# Altium schematic sheet InverterTranslation.SchDoc: Inverter Level Translation
size 279 x 215 mm; Engineer: Prasoon Sinha; DocumentNumber: 19; SheetNumber: 19; SheetTotal: 26
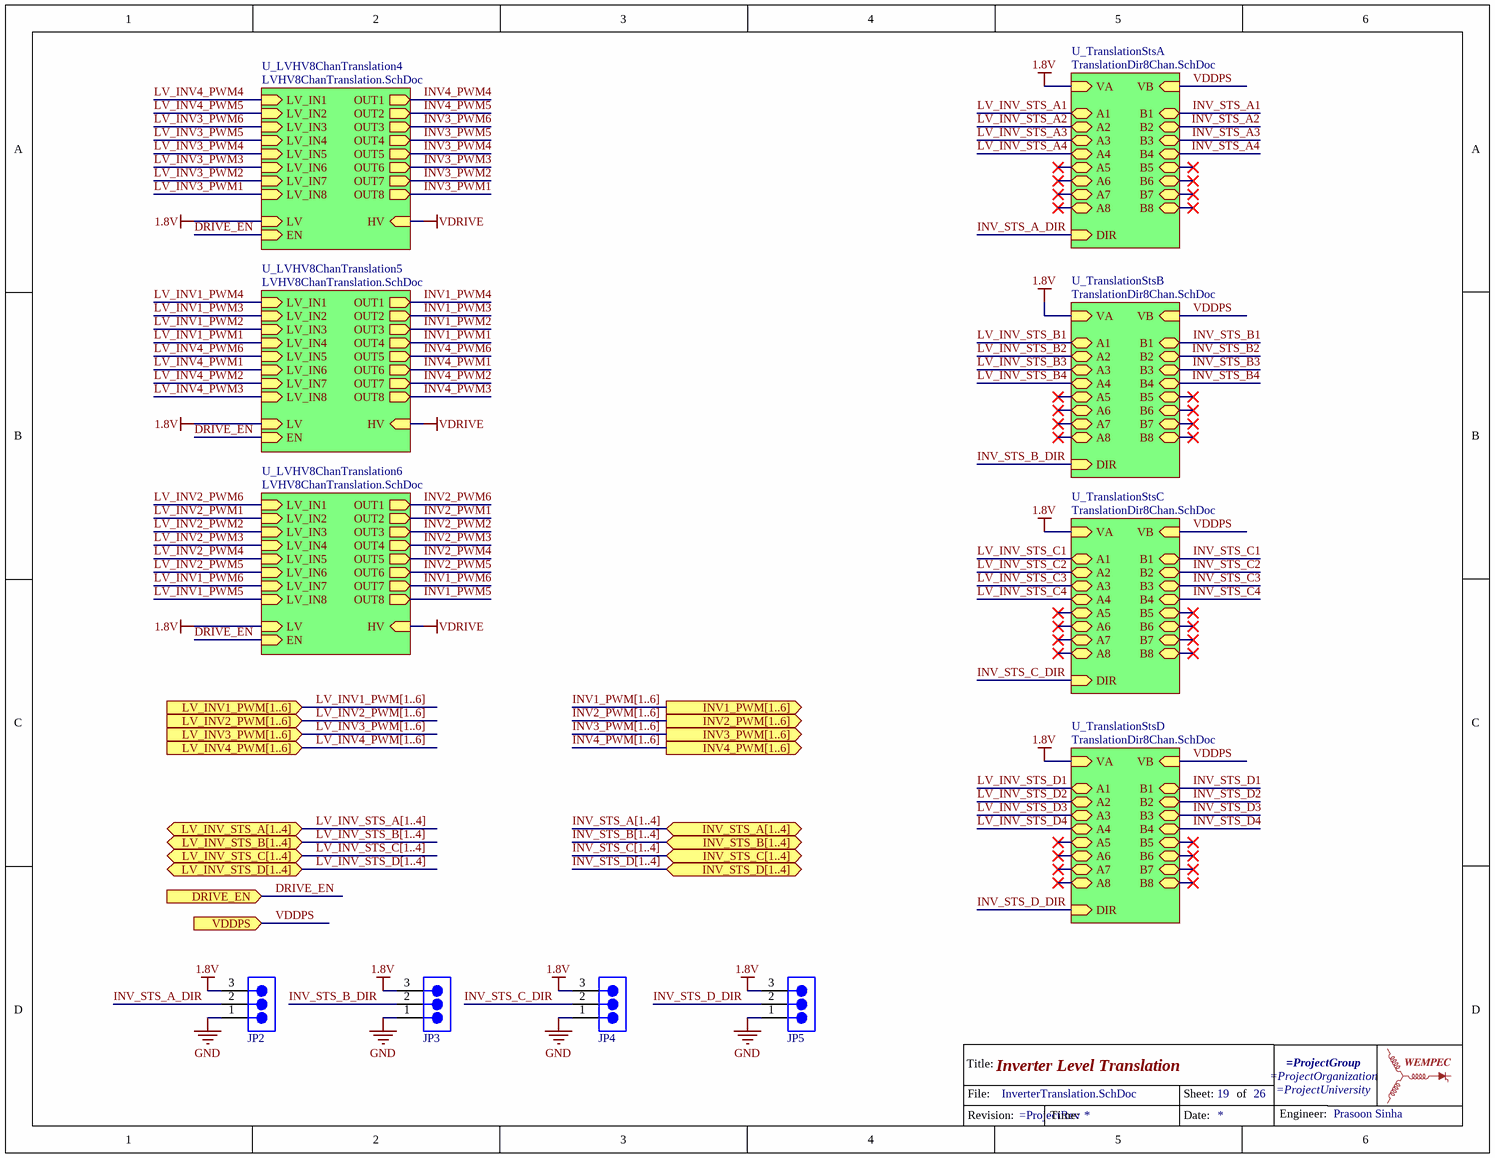
[diagram p0: InverterTranslation.SchDoc]

## Parts
*?  TitleBlockWEMPEC  (value not drawn)  (graphical)
JP2  Jumper3  [PIN_HEADER_1X3]  (value not drawn)
JP3  Jumper3  [PIN_HEADER_1X3]  (value not drawn)
JP4  Jumper3  [PIN_HEADER_1X3]  (value not drawn)
JP5  Jumper3  [PIN_HEADER_1X3]  (value not drawn)

## Sub-sheets
U_LVHV8ChanTranslation4 = LVHV8ChanTranslation.SchDoc: LV_IN1 (in), LV (in), HV (in), EN (in), OUT1 (out), OUT2 (out), OUT3 (out), OUT4 (out), LV_IN2 (in), LV_IN3 (in), LV_IN4 (in), LV_IN5 (in), LV_IN6 (in), LV_IN7 (in), LV_IN8 (in), OUT5 (out), OUT6 (out), OUT7 (out), OUT8 (out)
U_LVHV8ChanTranslation5 = LVHV8ChanTranslation.SchDoc: LV_IN1 (in), LV (in), HV (in), EN (in), OUT1 (out), OUT2 (out), OUT3 (out), OUT4 (out), LV_IN2 (in), LV_IN3 (in), LV_IN4 (in), LV_IN5 (in), LV_IN6 (in), LV_IN7 (in), LV_IN8 (in), OUT5 (out), OUT6 (out), OUT7 (out), OUT8 (out)
U_LVHV8ChanTranslation6 = LVHV8ChanTranslation.SchDoc: LV_IN1 (in), LV (in), HV (in), EN (in), OUT1 (out), OUT2 (out), OUT3 (out), OUT4 (out), LV_IN2 (in), LV_IN3 (in), LV_IN4 (in), LV_IN5 (in), LV_IN6 (in), LV_IN7 (in), LV_IN8 (in), OUT5 (out), OUT6 (out), OUT7 (out), OUT8 (out)
U_TranslationStsA = TranslationDir8Chan.SchDoc: VB (in), VA (in), B1 (bidir), B2 (bidir), B3 (bidir), B4 (bidir), A1 (bidir), A2 (bidir), A3 (bidir), A4 (bidir), DIR (in), B6 (bidir), A7 (bidir), B5 (bidir), A5 (bidir), B7 (bidir), A8 (bidir), A6 (bidir), B8 (bidir)
U_TranslationStsB = TranslationDir8Chan.SchDoc: VB (in), VA (in), B1 (bidir), B2 (bidir), B3 (bidir), B4 (bidir), A1 (bidir), A2 (bidir), A3 (bidir), A4 (bidir), DIR (in), B6 (bidir), A7 (bidir), B5 (bidir), A5 (bidir), B7 (bidir), A8 (bidir), A6 (bidir), B8 (bidir)
U_TranslationStsC = TranslationDir8Chan.SchDoc: VB (in), VA (in), B1 (bidir), B2 (bidir), B3 (bidir), B4 (bidir), A1 (bidir), A2 (bidir), A3 (bidir), A4 (bidir), DIR (in), B6 (bidir), A7 (bidir), B5 (bidir), A5 (bidir), B7 (bidir), A8 (bidir), A6 (bidir), B8 (bidir)
U_TranslationStsD = TranslationDir8Chan.SchDoc: VB (in), VA (in), B1 (bidir), B2 (bidir), B3 (bidir), B4 (bidir), A1 (bidir), A2 (bidir), A3 (bidir), A4 (bidir), DIR (in), B6 (bidir), A7 (bidir), B5 (bidir), A5 (bidir), B7 (bidir), A8 (bidir), A6 (bidir), B8 (bidir)

## Ports
DRIVE_EN (in), INV1_PWM[1..6] (out), INV2_PWM[1..6] (out), INV3_PWM[1..6] (out), INV4_PWM[1..6] (out), INV_STS_A[1..4] (bidir), INV_STS_B[1..4] (bidir), INV_STS_C[1..4] (bidir), INV_STS_D[1..4] (bidir), LV_INV1_PWM[1..6] (in), LV_INV2_PWM[1..6] (in), LV_INV3_PWM[1..6] (in), LV_INV4_PWM[1..6] (in), LV_INV_STS_A[1..4] (bidir), LV_INV_STS_B[1..4] (bidir), LV_INV_STS_C[1..4] (bidir), LV_INV_STS_D[1..4] (bidir), VDDPS (in)

## Nets
1.8V: JP2.3 JP3.3 JP4.3 JP5.3 ; sheet U_LVHV8ChanTranslation4/LV, sheet U_LVHV8ChanTranslation5/LV, sheet U_LVHV8ChanTranslation6/LV, sheet U_TranslationStsA/VA, sheet U_TranslationStsB/VA, sheet U_TranslationStsC/VA, sheet U_TranslationStsD/VA
GND: JP2.1 JP3.1 JP4.1 JP5.1
VDRIVE: sheet U_LVHV8ChanTranslation4/HV, sheet U_LVHV8ChanTranslation5/HV, sheet U_LVHV8ChanTranslation6/HV
DRIVE_EN: port DRIVE_EN, sheet U_LVHV8ChanTranslation4/EN, sheet U_LVHV8ChanTranslation5/EN, sheet U_LVHV8ChanTranslation6/EN
INV1_PWM1: sheet U_LVHV8ChanTranslation5/OUT4
INV1_PWM2: sheet U_LVHV8ChanTranslation5/OUT3
INV1_PWM3: sheet U_LVHV8ChanTranslation5/OUT2
INV1_PWM4: sheet U_LVHV8ChanTranslation5/OUT1
INV1_PWM5: sheet U_LVHV8ChanTranslation6/OUT8
INV1_PWM6: sheet U_LVHV8ChanTranslation6/OUT7
INV2_PWM1: sheet U_LVHV8ChanTranslation6/OUT2
INV2_PWM2: sheet U_LVHV8ChanTranslation6/OUT3
INV2_PWM3: sheet U_LVHV8ChanTranslation6/OUT4
INV2_PWM4: sheet U_LVHV8ChanTranslation6/OUT5
INV2_PWM5: sheet U_LVHV8ChanTranslation6/OUT6
INV2_PWM6: sheet U_LVHV8ChanTranslation6/OUT1
INV3_PWM1: sheet U_LVHV8ChanTranslation4/OUT8
INV3_PWM2: sheet U_LVHV8ChanTranslation4/OUT7
INV3_PWM3: sheet U_LVHV8ChanTranslation4/OUT6
INV3_PWM4: sheet U_LVHV8ChanTranslation4/OUT5
INV3_PWM5: sheet U_LVHV8ChanTranslation4/OUT4
INV3_PWM6: sheet U_LVHV8ChanTranslation4/OUT3
INV4_PWM1: sheet U_LVHV8ChanTranslation5/OUT6
INV4_PWM2: sheet U_LVHV8ChanTranslation5/OUT7
INV4_PWM3: sheet U_LVHV8ChanTranslation5/OUT8
INV4_PWM4: sheet U_LVHV8ChanTranslation4/OUT1
INV4_PWM5: sheet U_LVHV8ChanTranslation4/OUT2
INV4_PWM6: sheet U_LVHV8ChanTranslation5/OUT5
INV_STS_A1: sheet U_TranslationStsA/B1
INV_STS_A2: sheet U_TranslationStsA/B2
INV_STS_A3: sheet U_TranslationStsA/B3
INV_STS_A4: sheet U_TranslationStsA/B4
INV_STS_A_DIR: JP2.2 ; sheet U_TranslationStsA/DIR
INV_STS_B1: sheet U_TranslationStsB/B1
INV_STS_B2: sheet U_TranslationStsB/B2
INV_STS_B3: sheet U_TranslationStsB/B3
INV_STS_B4: sheet U_TranslationStsB/B4
INV_STS_B_DIR: JP3.2 ; sheet U_TranslationStsB/DIR
INV_STS_C1: sheet U_TranslationStsC/B1
INV_STS_C2: sheet U_TranslationStsC/B2
INV_STS_C3: sheet U_TranslationStsC/B3
INV_STS_C4: sheet U_TranslationStsC/B4
INV_STS_C_DIR: JP4.2 ; sheet U_TranslationStsC/DIR
INV_STS_D1: sheet U_TranslationStsD/B1
INV_STS_D2: sheet U_TranslationStsD/B2
INV_STS_D3: sheet U_TranslationStsD/B3
INV_STS_D4: sheet U_TranslationStsD/B4
INV_STS_D_DIR: JP5.2 ; sheet U_TranslationStsD/DIR
LV_INV1_PWM1: sheet U_LVHV8ChanTranslation5/LV_IN4
LV_INV1_PWM2: sheet U_LVHV8ChanTranslation5/LV_IN3
LV_INV1_PWM3: sheet U_LVHV8ChanTranslation5/LV_IN2
LV_INV1_PWM4: sheet U_LVHV8ChanTranslation5/LV_IN1
LV_INV1_PWM5: sheet U_LVHV8ChanTranslation6/LV_IN8
LV_INV1_PWM6: sheet U_LVHV8ChanTranslation6/LV_IN7
LV_INV2_PWM1: sheet U_LVHV8ChanTranslation6/LV_IN2
LV_INV2_PWM2: sheet U_LVHV8ChanTranslation6/LV_IN3
LV_INV2_PWM3: sheet U_LVHV8ChanTranslation6/LV_IN4
LV_INV2_PWM4: sheet U_LVHV8ChanTranslation6/LV_IN5
LV_INV2_PWM5: sheet U_LVHV8ChanTranslation6/LV_IN6
LV_INV2_PWM6: sheet U_LVHV8ChanTranslation6/LV_IN1
LV_INV3_PWM1: sheet U_LVHV8ChanTranslation4/LV_IN8
LV_INV3_PWM2: sheet U_LVHV8ChanTranslation4/LV_IN7
LV_INV3_PWM3: sheet U_LVHV8ChanTranslation4/LV_IN6
LV_INV3_PWM4: sheet U_LVHV8ChanTranslation4/LV_IN5
LV_INV3_PWM5: sheet U_LVHV8ChanTranslation4/LV_IN4
LV_INV3_PWM6: sheet U_LVHV8ChanTranslation4/LV_IN3
LV_INV4_PWM1: sheet U_LVHV8ChanTranslation5/LV_IN6
LV_INV4_PWM2: sheet U_LVHV8ChanTranslation5/LV_IN7
LV_INV4_PWM3: sheet U_LVHV8ChanTranslation5/LV_IN8
LV_INV4_PWM4: sheet U_LVHV8ChanTranslation4/LV_IN1
LV_INV4_PWM5: sheet U_LVHV8ChanTranslation4/LV_IN2
LV_INV4_PWM6: sheet U_LVHV8ChanTranslation5/LV_IN5
LV_INV_STS_A1: sheet U_TranslationStsA/A1
LV_INV_STS_A2: sheet U_TranslationStsA/A2
LV_INV_STS_A3: sheet U_TranslationStsA/A3
LV_INV_STS_A4: sheet U_TranslationStsA/A4
LV_INV_STS_B1: sheet U_TranslationStsB/A1
LV_INV_STS_B2: sheet U_TranslationStsB/A2
LV_INV_STS_B3: sheet U_TranslationStsB/A3
LV_INV_STS_B4: sheet U_TranslationStsB/A4
LV_INV_STS_C1: sheet U_TranslationStsC/A1
LV_INV_STS_C2: sheet U_TranslationStsC/A2
LV_INV_STS_C3: sheet U_TranslationStsC/A3
LV_INV_STS_C4: sheet U_TranslationStsC/A4
LV_INV_STS_D1: sheet U_TranslationStsD/A1
LV_INV_STS_D2: sheet U_TranslationStsD/A2
LV_INV_STS_D3: sheet U_TranslationStsD/A3
LV_INV_STS_D4: sheet U_TranslationStsD/A4
VDDPS: port VDDPS, sheet U_TranslationStsA/VB, sheet U_TranslationStsB/VB, sheet U_TranslationStsC/VB, sheet U_TranslationStsD/VB

## Buses and harness runs
bus INV1_PWM[1..6] = port INV1_PWM[1..6]
bus INV2_PWM[1..6] = port INV2_PWM[1..6]
bus INV3_PWM[1..6] = port INV3_PWM[1..6]
bus INV4_PWM[1..6] = port INV4_PWM[1..6]
bus INV_STS_A[1..4] = port INV_STS_A[1..4]
bus INV_STS_B[1..4] = port INV_STS_B[1..4]
bus INV_STS_C[1..4] = port INV_STS_C[1..4]
bus INV_STS_D[1..4] = port INV_STS_D[1..4]
bus LV_INV1_PWM[1..6] = port LV_INV1_PWM[1..6]
bus LV_INV2_PWM[1..6] = port LV_INV2_PWM[1..6]
bus LV_INV3_PWM[1..6] = port LV_INV3_PWM[1..6]
bus LV_INV4_PWM[1..6] = port LV_INV4_PWM[1..6]
bus LV_INV_STS_A[1..4] = port LV_INV_STS_A[1..4]
bus LV_INV_STS_B[1..4] = port LV_INV_STS_B[1..4]
bus LV_INV_STS_C[1..4] = port LV_INV_STS_C[1..4]
bus LV_INV_STS_D[1..4] = port LV_INV_STS_D[1..4]

## Notes on the sheet
- (in symbol TitleBlockWEMPEC) Title:; File:; Sheet:; of; Engineer:; Revision:; Time:; Date:

## Library data of the parts
JP2-JP5 = Jumper3: Supplier 1: Digi-Key; Supplier Part Number 1: 732-5316-ND